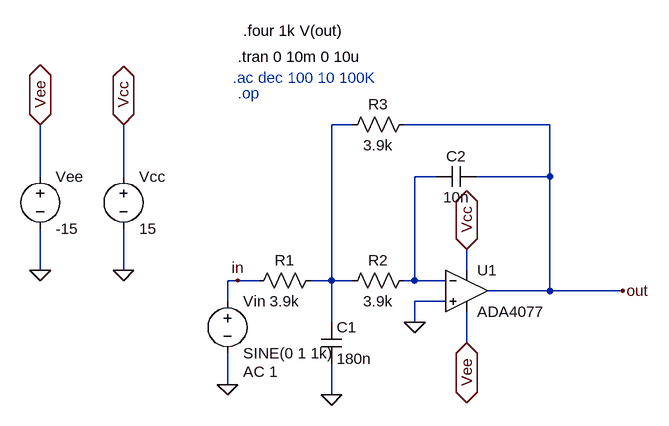
[diagram p0: schematic etaj2_LPF_rauch.asc]
etaj2_LPF_rauch.asc, the LTspice schematic file:
Version 4.1
SHEET 1 880 680
WIRE 32 -96 0 -96
WIRE 336 -96 112 -96
WIRE -448 -16 -448 -96
WIRE -320 -16 -320 -96
WIRE 160 -16 128 -16
WIRE 336 -16 336 -96
WIRE 336 -16 224 -16
WIRE -448 128 -448 64
WIRE -320 128 -320 64
WIRE 208 128 208 96
WIRE -144 144 -160 144
WIRE -112 144 -144 144
WIRE 0 144 0 -96
WIRE 0 144 -32 144
WIRE 32 144 0 144
WIRE 128 144 128 -16
WIRE 128 144 112 144
WIRE 176 144 128 144
WIRE 336 160 336 -16
WIRE 336 160 240 160
WIRE 448 160 336 160
WIRE -160 176 -160 144
WIRE 176 176 128 176
WIRE 0 208 0 144
WIRE 128 208 128 176
WIRE 208 240 208 192
WIRE -160 304 -160 256
WIRE 0 320 0 272
FLAG 128 208 0
FLAG -448 128 0
FLAG -320 128 0
FLAG -320 -96 Vcc
IOPIN -320 -96 BiDir
FLAG -448 -96 Vee
IOPIN -448 -96 BiDir
FLAG 208 96 Vcc
IOPIN 208 96 BiDir
FLAG 208 240 Vee
IOPIN 208 240 BiDir
FLAG 448 160 out
FLAG 0 320 0
FLAG -160 304 0
FLAG -144 144 in
SYMBOL OpAmps\\ADA4077 208 96 R0
SYMATTR InstName U1
SYMBOL res -16 128 R90
WINDOW 0 0 56 VBottom 2
WINDOW 3 32 56 VTop 2
SYMATTR InstName R1
SYMATTR Value 3.9k
SYMBOL res 128 128 R90
WINDOW 0 0 56 VBottom 2
WINDOW 3 32 56 VTop 2
SYMATTR InstName R2
SYMATTR Value 3.9k
SYMBOL res 128 -112 R90
WINDOW 0 0 56 VBottom 2
WINDOW 3 32 56 VTop 2
SYMATTR InstName R3
SYMATTR Value 3.9k
SYMBOL cap 224 -32 R90
WINDOW 0 0 32 VBottom 2
WINDOW 3 32 32 VTop 2
SYMATTR InstName C2
SYMATTR Value 10n
SYMATTR SpiceLine IC=0
SYMBOL voltage -320 -32 R0
SYMATTR InstName Vcc
SYMATTR Value 15
SYMBOL voltage -448 -32 R0
SYMATTR InstName Vee
SYMATTR Value -15
SYMBOL cap -16 208 R0
SYMATTR InstName C1
SYMATTR Value 180n
SYMATTR SpiceLine IC=0
SYMBOL voltage -160 160 R0
WINDOW 123 24 124 Left 2
WINDOW 39 0 0 Left 0
SYMATTR Value2 AC 1
SYMATTR InstName Vin
SYMATTR Value SINE(0 1 1k)
TEXT -144 -144 Left 2 ;.op
TEXT -152 -168 Left 2 ;.ac dec 100 10 100K
TEXT -144 -200 Left 2 !.tran 0 10m 0 10u
TEXT -136 -240 Left 2 !.four 1k V(out)

The netlist it stands for:
* etaj2_LPF_rauch.asc
X§U1 0 N002 Vcc Vee out ADA4077  ; pins In+ In- V+ V- OUT
R1 N001 in 3.9k
R2 N002 N001 3.9k
R3 out N001 3.9k
C2 out N002 10n IC=0
Vcc Vcc 0 15
Vee Vee 0 -15
C1 N001 0 180n IC=0
Vin in 0 SINE(0 1 1k) AC 1
* .op
* .ac dec 100 10 100K
.tran 0 10m 0 10u
.four 1k V(out)
.backanno
.end